# EAGLE design RPCamV2_Alt_camera_boardV2 (EAGLE 9.3.2)
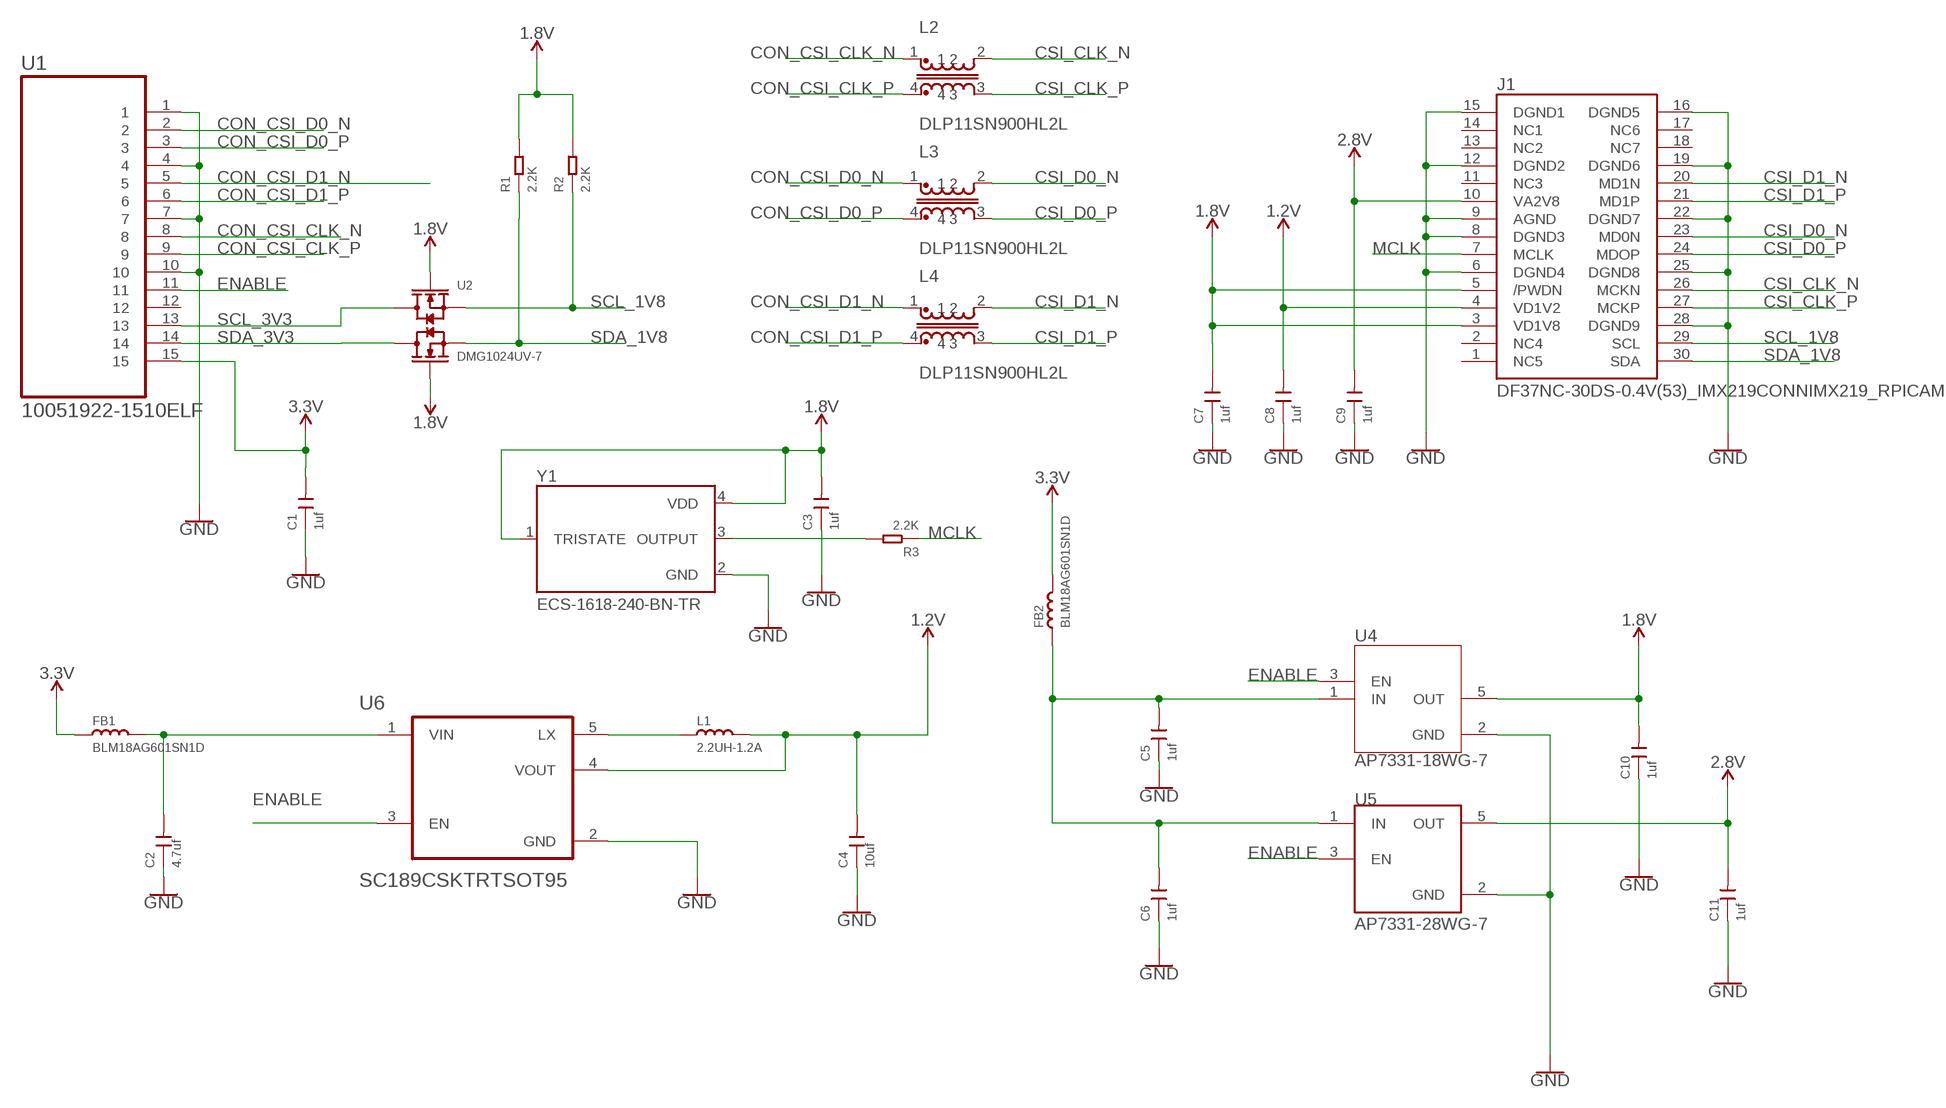
[diagram p0: schematic, sheet 1]

## Parts
C1  1uf  CERAMIC-1UF-10V-10%-X5R(0402)  [C0402K]
C2  4.7uf  CERAMIC-4.7UF-10V-10%-X5R(0603)  [C0603]
C3  1uf  CERAMIC-1UF-10V-10%-X5R(0402)  [C0402K]
C4  10uf  CERAMIC-10UF-25V-10%-X5R(0805)  [C2012]
C5  1uf  CERAMIC-1UF-10V-10%-X5R(0402)  [C0402K]
C6  1uf  CERAMIC-1UF-10V-10%-X5R(0402)  [C0402K]
C7  1uf  CERAMIC-1UF-10V-10%-X5R(0402)  [C0402K]
C8  1uf  CERAMIC-1UF-10V-10%-X5R(0402)  [C0402K]
C9  1uf  CERAMIC-1UF-10V-10%-X5R(0402)  [C0402K]
C10  1uf  CERAMIC-1UF-10V-10%-X5R(0402)  [C0402K]
C11  1uf  CERAMIC-1UF-10V-10%-X5R(0402)  [C0402K]
FB1  BLM18AG601SN1D  [BEADC1608X80]
FB2  BLM18AG601SN1D  [BEADC1608X80]
J1  DF37NC-30DS-0.4V(53)_IMX219CONNIMX219_RPICAM  [HRS_DF37NC-30DS-0.4V(53)_IMX219]
L1  2.2UH-1.2A  SMD-INDUCTOR-2.2UH-20%-1.2A(0805)  [L0805]
L2  DLP11SN900HL2L  [INDC1210X09]
L3  DLP11SN900HL2L  [INDC1210X09]
L4  DLP11SN900HL2L  [INDC1210X09]
R1  2.2K  SMD-RES-2.2K-5%-1/16W(0402)  [R0402]
R2  2.2K  SMD-RES-2.2K-5%-1/16W(0402)  [R0402]
R3  2.2K  SMD-RES-2.2K-5%-1/16W(0402)  [R0402]
U1  10051922-1510ELF  [FCI_10051922-1510ELF]
U2  DMG1024UV-7  [SOT50P162X60-6N]
U4  AP7331-18WG-7  [SOT95P285X145-5N]
U5  AP7331-28WG-7  [SOT95P285X145-5N]
U6  SC189CSKTRTSOT95  [SOT95P285X145-5N]
Y1  ECS-1618-240-BN-TR  [XTAL_ECS-1618-060-BN-TR]

## Nets
1.2V [pwr]: C4.2 C8.2 J1.4(VD1V2) L1.2 U6.4(VOUT)
1.8V [pwr]: C3.2 C7.2 C10.2 J1.3(VD1V8) J1.5(/PWDN) R1.2 R2.2 U2.G1(G0) U2.G2(G1) U4.5(OUT) Y1.1(TRISTATE) Y1.4(VDD)
2.8V [pwr]: C9.2 C11.2 J1.10(VA2V8) U5.5(OUT)
3V3 [pwr]: C1.2 FB1.1 FB2.2 U1.15 ; supply symbol labelled 3.3V
CON_CSI_CLK_N [diff pairs]: L2.1 U1.8
CON_CSI_CLK_P [diff pairs]: L2.4 U1.9
CON_CSI_D0_N [diff pairs]: L3.1 U1.2
CON_CSI_D0_P [diff pairs]: L3.4 U1.3
CON_CSI_D1_N [diff pairs]: L4.1 U1.5
CON_CSI_D1_P [diff pairs]: L4.4 U1.6
CSI_CLK_N [diff pairs]: J1.26(MCKN) L2.2
CSI_CLK_P [diff pairs]: J1.27(MCKP) L2.3
CSI_D0_N [diff pairs]: J1.23(MD0N) L3.2
CSI_D0_P [diff pairs]: J1.24(MDOP) L3.3
CSI_D1_N [diff pairs]: J1.20(MD1N) L4.2
CSI_D1_P [diff pairs]: J1.21(MD1P) L4.3
ENABLE: U1.11 U4.3(EN) U5.3(EN) U6.3(EN)
GND [pwr]: C1.1 C2.1 C3.1 C4.1 C5.1 C6.1 C7.1 C8.1 C9.1 C10.1 C11.1 J1.6(DGND4) J1.8(DGND3) J1.9(AGND) J1.12(DGND2) J1.15(DGND1) J1.16(DGND5) J1.19(DGND6) J1.22(DGND7) J1.25(DGND8) J1.28(DGND9) U1.1 U1.4 U1.7 U1.10 U4.2(GND) U5.2(GND) U6.2(GND) Y1.2(GND)
IN_PR: C5.2 C6.2 FB2.1 U4.1(IN) U5.1(IN)
MCLK: J1.7(MCLK) R3.1
N$1: C2.2 FB1.2 U6.1(VIN)
N$5: R3.2 Y1.3(OUTPUT)
N$7 [pwr]: L1.1 U6.5(LX)
SCL_1V8: J1.29(SCL) R2.1 U2.S2(S1)
SCL_3V3: U1.13 U2.D2(D1)
SDA_1V8: J1.30(SDA) R1.1 U2.S1(S0)
SDA_3V3: U1.14 U2.D1(D0)
Unconnected: J1.1(NC5) J1.2(NC4) J1.11(NC3) J1.13(NC2) J1.14(NC1) J1.17(NC6) J1.18(NC7) U1.12

## Library data of the parts
C1 C3 C5-C11 = RPI_CAM:CERAMIC-1UF-10V-10%-X5R(0402): 302010040; MPN: MF-CAP-0402-1uF; MPN_SEEED: CC0402KRX5R6BB105
C2 = RPI_CAM:CERAMIC-4.7UF-10V-10%-X5R(0603): 302010111; MPN: CC0603KRX5R6BB475
C4 = RPI_CAM:CERAMIC-10UF-25V-10%-X5R(0805): 302010178; MPN: CC0805KKX5R8BB106
FB1 FB2 = RPI_CAM:BLM18AG601SN1D: Ferrite Beads Multi-Layer 600Ohm 25% 100MHz 500mA 380mOhm DCR 0603 Paper T/R; MPN: BLM18AG601SN1D
J1 = RPI_CAM:DF37NC-30DS-0.4V(53)_IMX219CONN: Connector, Stacking, Rcpt, 30pos, 2row; MPN: DF37NC-30DS-0.4V(51)
L1 = RPI_CAM:SMD-INDUCTOR-2.2UH-20%-1.2A(0805): 303010086; MPN: LQM2MPN2R2MG0
L2-L4 = RPI_CAM:DLP11SN900HL2L: MURATA# DLP11SN900HL2L, D LP Series 90 Ohm Impedanc e 20 % 150 mA DCR 1.5 Ohm SMT Common Mode Choke; AVAILABILITY: Unavailable; DESCRIPTION: MURATA# DLP11SN900HL2L, D LP Series 90 Ohm Impedanc e 20 % 150 mA DCR 1.5 Ohm SMT Common Mode Choke; MF: Murata; MPN: DLP11SN900HL2L; PACKAGE: 1210 Murata; PRICE: None
R1-R3 = RPI_CAM:SMD-RES-2.2K-5%-1/16W(0402): 301010039; MPN: RC0402JR-072K2L
U1 = RPI_CAM:10051922-1510ELF: FFC/FPC CONNECTOR, 15POS, 1ROW; AVAILABILITY: Good; DESCRIPTION: Conn; Rect; FPC/FFC; ZIF; 15Cnts; SMT; VLL Series; 0.5mmPinSpng; RtAng; LowerSideContact; MF: FCI; MPN: 10051922-1510ELF; PACKAGE: None; PRICE: 0.44 USD
U2 = RPI_CAM:DMG1024UV-7: Dual N-Channel 20 V 450 mOhm Surface Mount Enhancement Mode Mosfet - SOT-563; AVAILABILITY: Good; DESCRIPTION: Dual N-Channel 20 V 450 mOhm Surface Mount Enhancement Mode Mosfet - SOT-563; MF: Diodes Inc.; MPN: DMG1024UV-7; PACKAGE: SOT-563 Diodes Inc.; PRICE: 0.19 USD
U4 = RPI_CAM:AP7331-18WG-7: LDO Regulator Pos 1.8V 0.3A 5-Pin SOT-25 T/R; AVAILABILITY: Good; DESCRIPTION: LDO Regulator Pos 1.8V 0.3A 5-Pin SOT-25 T/R; MF: Diodes Inc.; MPN: AP7331-18WG-7; PACKAGE: SOT-753 Diodes Inc.; PRICE: 0.20 USD
U5 = RPI_CAM:AP7331-28WG-7: LDO Regulator Pos 2.8V 0.3A 5-Pin SOT-25 T/R; AVAILABILITY: Good; DESCRIPTION: LDO Regulator Pos 2.8V 0.3A 5-Pin SOT-25 T/R; MF: Diodes Inc.; MPN: AP7331-28WG-7; PACKAGE: SOT-753 Diodes Inc.; PRICE: 0.21 USD
U6 = RPI_CAM:SC189CSKTRT: 1.2V Switching Voltage Regulators 2.5MHz-1.5A SYNC STEP DOWN REG None; MPN: SC189CSKTRT
Y1 = RPI_CAM:ECS-1618-240-BN-TR: OSC XO 12.000MHZ CMOS SMD; DESCRIPTION: Clock Oscillator 24MHz 1.8V 15pF 4-Pin SMD T/R; DIGI-KEY_PART_NUMBER: XC1963CT-ND; DIGI-KEY_PURCHASE_URL: https://www.digikey.com.au/product-detail/en/ecs-inc/ECS-1618-240-BN-TR/XC1963CT-ND/3927364?utm_source=snapeda&utm_medium=aggregator&utm_campaign=symbol; MF: ECS International; MPN: ECS-1618-240-BN-TR; PACKAGE: SMD-4 ECS International

## Net classes
1 diff pairs: width 0.203 mm, clearance 0.152 mm
2 pwr: width 0.152 mm

## Board
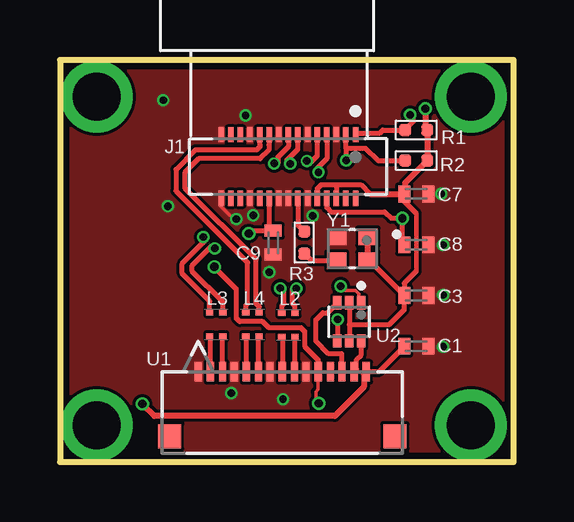
[diagram p1: board, top side]
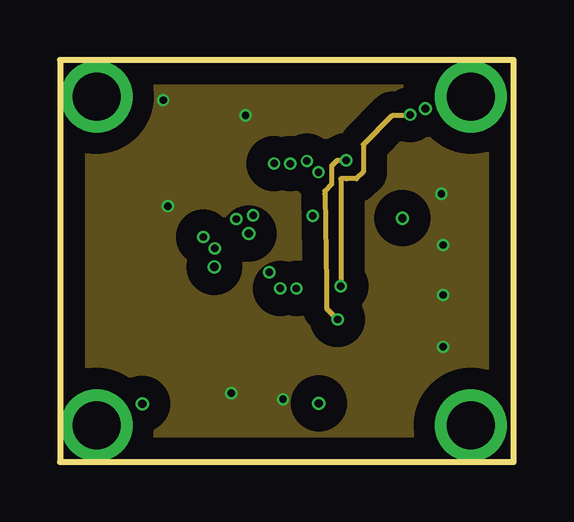
[diagram p2: board, inner layer Route2]
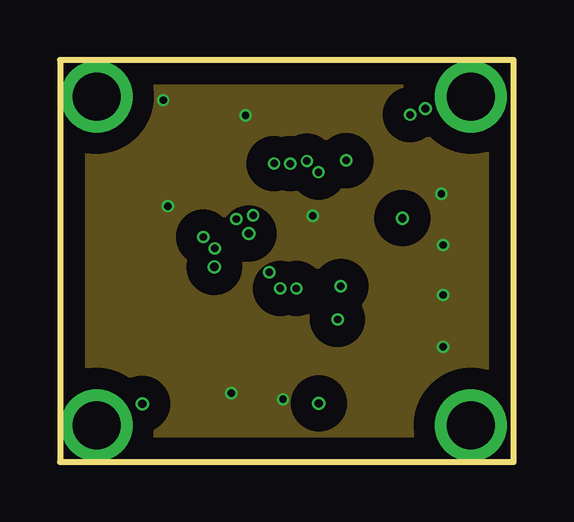
[diagram p3: board, inner layer Route15]
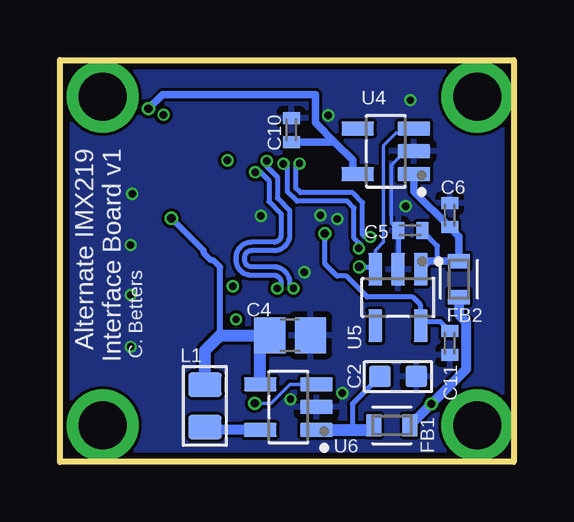
[diagram p4: board, bottom side, seen from below]

Size 18.92 x 16.76 mm. Coordinates in mm from the lower left corner, seen from the top.
Outline: 0,0 18.92,0 18.92,16.76 0,16.76 0,0
Copper layers (1*2*15*16): Top 0.035mm / dielectric 0.23mm / Route2 0.035mm / dielectric 0.93mm / Route15 0.035mm / dielectric 0.23mm / Bottom 0.035mm
Design rules "MF_Standard_4_Layer": minimum track width 5mil, minimum drill 10mil, track to track 5mil, track to pad 5mil, pad to pad 5mil, via to via 5mil, smd to smd 0mil, copper to edge 10mil, drill to drill 10mil, minimum pad ring 4mil, minimum via ring 4mil, stop-mask expansion 2mil, vias tented up to drill 25mil, thermal gap 10mil

### Footprints (pad centres in the part's own frame; a part is rotated, then mirrored left to right if it is on the bottom)
C0402K = smd 0.5 x 0.7: 1 -0.5,0; 2 0.5,0
C0603 = smd 0.889 x 0.889: 1 -0.762,0; 2 0.762,0
C2012 = smd 1.3 x 1.5: 1 -0.85,0; 2 0.85,0
BEADC1608X80 = smd 0.612 x 0.912: 1 -0.75,0; 2 0.75,0
HRS_DF37NC-30DS-0.4V(53)_IMX219 = smd 0.23 x 0.63: 1 -2.8,1.325; 2 -2.4,1.325; 3 -2,1.325; 4 -1.6,1.325; 5 -1.2,1.325; 6 -0.8,1.325; 7 -0.4,1.325; 8 0,1.325; 9 0.4,1.325; 10 0.8,1.325; 11 1.2,1.325; 12 1.6,1.325; 13 2,1.325; 14 2.4,1.325; 15 2.8,1.325; 16 2.8,-1.325; 17 2.4,-1.325; 18 2,-1.325; 19 1.6,-1.325; 20 1.2,-1.325; 21 0.8,-1.325; 22 0.4,-1.325; 23 0,-1.325; 24 -0.4,-1.325; 25 -0.8,-1.325; 26 -1.2,-1.325; 27 -1.6,-1.325; 28 -2,-1.325; 29 -2.4,-1.325; 30 -2.8,-1.325
L0805 = smd 1.016 x 1.397: 1 -0.889,0; 2 0.889,0
INDC1210X09 = smd 0.25 x 0.3: 1 -0.5,0.275; 2 0.5,0.275; 3 0.5,-0.275; 4 -0.5,-0.275
R0402 = smd 0.5 x 0.5: 1 0,0.463; 2 0,-0.463
FCI_10051922-1510ELF = smd 0.305 x 0.813: 1 3.505,-2.108; 2 2.997,-2.108; 3 2.489,-2.108; 4 2.007,-2.108; 5 1.499,-2.108; 6 0.991,-2.108; 7 0.508,-2.108; 8 0,-2.108; 9 -0.508,-2.108; 10 -0.991,-2.108; 11 -1.499,-2.108; 12 -2.007,-2.108; 13 -2.489,-2.108; 14 -2.997,-2.108; 15 -3.505,-2.108 | smd 0.965 x 1.016: 16 -4.699,0.584; 17 4.699,0.584
SOT50P162X60-6N = smd 0.55 x 0.34: D1 0.795,0.5; D2 -0.795,-0.5; G1 -0.795,0; G2 0.795,0; S1 -0.795,0.5; S2 0.795,-0.5
SOT95P285X145-5N = smd 1.37 x 0.59: 1 -1.175,0.95; 2 -1.175,0; 3 -1.175,-0.95; 4 1.175,-0.95; 5 1.175,0.95
XTAL_ECS-1618-060-BN-TR = smd 0.8 x 0.7: 1 -0.65,-0.5; 2 0.65,-0.5; 3 0.65,0.5; 4 -0.65,0.5

### Placement (x,y rotation side)
C1  14.86,4.83 180 top
C2  4.83,3.56 180 bottom
C3  14.86,6.94 180 top
C4  9.32,5.28 180 bottom
C5  4.32,9.65 0 bottom
C6  2.67,10.29 270 bottom
C7  14.86,11.18 180 top
C8  14.86,9.06 180 top
C9  8.89,9.15 90 top
C10  9.27,13.84 270 bottom
C11  2.67,4.95 90 bottom
FB1  5.08,1.52 180 bottom
FB2  2.29,7.62 270 bottom
J1  9.53,12.32 180 top
L1  12.88,2.34 90 bottom
L2  9.53,5.71 90 top
L3  6.52,5.73 90 top
L4  8.03,5.73 90 top
R1  14.86,13.84 90 top
R2  14.86,12.57 90 top
R3  10.19,9.15 0 top
U1  9.27,1.65 180 top
U2  12.06,5.84 270 top
U4  5.33,12.95 180 bottom
U5  4.83,6.86 270 bottom
U6  9.4,2.29 180 bottom
Y1  12.19,8.89 180 top

### Tracks (layer width: path | path; a pad name or v marks a point on that pad's centre or on a via)
1.2V  (via drill 0.35)
  Top 0.203: J1.4 11.12,10.61 11.3,10.43 13.55,10.43 13.81,10.16 v14.28,10.16 14.28,9.14 C8.2
  Bottom 0.254: 12.24,5.28 12.24,8.13 12.53,8.41 12.63,8.41 12.93,8.71 12.93,8.81 v14.28,10.16
  Bottom 0.508: U6.4 10.57,4.88 C4.2 12.24,5.28 12.88,4.65 L1.2
1.8V  (via drill 0.35)
  Top 0.178: 14.86,10.36 14.86,7.95
  Top 0.203: 11.53,11.56 J1.3 | J1.5 10.72,11.38 10.9,11.56 11.53,11.56 | 11.53,11.56 12.54,11.56 12.93,11.18 | U2.G1 12.06,5.71 | 12.06,5.71 U2.G2 | C3.2 12.91,8.39 Y1.4 | C3.2 14.36,6.35 13.73,5.72 12.07,5.72 12.06,5.71 | C7.2 14.36,10.86 14.86,10.36 | C3.2 14.36,7.45 14.86,7.95
  Top 0.254: v15.24,14.73 15.24,13.97 15.32,13.89 R1.2 R2.2 14.4,11.65 C7.2 12.93,11.18 | Y1.4 Y1.1
  Bottom 0.305: v15.24,14.73 14.65,15.32 8.27,15.32 8.27,14.15 7.47,13.34 | U4.5 6.71,12.2 6.71,12.58 7.47,13.34 | C10.2 7.47,13.34
2.8V  (via drill 0.35)
  Top 0.203: v7.87,9.53 8,9.65 C9.2 8.72,9.81 J1.10
  Bottom 0.152: 3.94,5.57 3.86,5.66
  Bottom 0.203: v7.87,9.53 7.87,8.26 7.37,7.75 6.98,7.75 6.1,6.87 4.21,6.87 3.88,6.54 3.88,5.84 | U5.5 3.88,5.84 | C11.2 3.06,5.84 3.88,5.84
  Bottom 0.305: 3.86,5.66 U5.5
3V3  (via drill 0.35)
  Top 0.203: C1.2 13.29,3.76 U1.15
  Top 0.254: U1.15 12.68,3.66 12.68,3.12 11.46,1.91 3.94,1.91 v3.44,2.42
  Bottom 0.406: FB2.2 2.29,6.14 1.99,5.84 1.99,3.87 v3.44,2.42 FB1.1
CON_CSI_CLK_N
  Top 0.203: L2.1 9.27,5.19 U1.8
CON_CSI_CLK_P
  Top 0.203: U1.9 9.8,3.78 L2.4
CON_CSI_D0_N
  Top 0.203: U1.2 6.27,5.2 L3.1
CON_CSI_D0_P
  Top 0.203: U1.3 L3.4
CON_CSI_D1_N
  Top 0.203: U1.5 7.77,5.21 L4.1
CON_CSI_D1_P
  Top 0.203: U1.6 8.28,5.21 L4.4
CSI_CLK_N  (via drill 0.3)
  Top 0.203: J1.26 10.72,12.75 10.41,12.44 v10.3,12.55 | L2.2 9.25,6.51 9.35,6.6 9.35,7.24 v9.19,7.24
  Bottom 0.203: v10.3,12.55 10.41,12.44 9.86,11.88 9.86,11 9.35,10.49 9.35,9.45 arc90 9.99,8.81 10.94,8.81 arc-90 11.23,8.52 11.23,8.43 arc-90 10.94,8.14 9.99,8.14 arc90 9.35,7.49 9.35,7.24 v9.19,7.24
CSI_CLK_P  (via drill 0.3)
  Top 0.203: J1.27 11.12,12.65 10.67,12.19 v10.78,12.08 | L2.3 9.8,6.51 9.7,6.6 9.7,7.24 v9.86,7.24
  Bottom 0.203: v10.78,12.08 10.67,12.19 10.21,11.74 10.21,10.85 9.7,10.34 9.7,9.45 arc90 9.99,9.16 10.94,9.16 arc-90 11.59,8.52 11.59,8.43 arc-90 10.94,7.79 9.99,7.79 arc90 9.7,7.49 9.7,7.24 v9.86,7.24
CSI_D0_N  (via drill 0.3)
  Top 0.203: J1.23 9.53,13.14 9.09,12.71 9.09,12.45 v8.93,12.45 | L3.2 6.25,6.71 5.1,7.86 5.1,8.27 6.09,9.27 v5.98,9.38
  Bottom 0.203: v8.93,12.45 9.09,12.45 9.09,11.42 8.9,11.23 6.71,11.23 6.3,10.82 6.3,9.47 6.09,9.27 v5.98,9.38
CSI_D0_P  (via drill 0.3)
  Top 0.203: J1.24 9.93,13.04 9.45,12.56 9.45,12.44 v9.61,12.44 | L3.3 6.79,6.66 5.51,7.95 5.51,8.18 6.35,9.02 v6.46,8.91
  Bottom 0.203: v9.61,12.44 9.45,12.44 9.45,11.27 9.05,10.87 6.93,10.87 6.66,10.59 6.66,9.32 6.35,9.02 v6.46,8.91
CSI_D1_N
  Top 0.203: J1.20 8.32,13.26 8.35,13.23 8.35,13.15 8.2,13.01 5.64,13.01 4.83,12.2 4.83,11.3 7.82,8.31 7.82,6.6 7.75,6.54 L4.2
CSI_D1_P
  Top 0.203: J1.21 8.72,13.24 8.71,13.23 8.71,13.01 8.35,12.65 5.79,12.65 5.2,12.06 5.2,11.43 8.18,8.46 8.18,6.6 8.3,6.48 L4.3
ENABLE  (via drill 0.35)
  Top 0.152: U1.11 10.77,3.02 10.67,2.92 10.67,2.57 v10.79,2.44
  Top 0.203: v6.44,8.13 7.35,7.22 7.35,6 7.5,5.85 8.45,5.85 8.71,5.59 10.05,5.59 10.2,5.45 10.2,4.83 10.77,4.26 U1.11
  Bottom 0.152: U4.3 4.36,13.71 4.9,13.71 5.42,13.19 5.42,9.17 5.78,8.82 U5.3 | U6.3 9.33,3.24 10.13,2.44 v10.79,2.44
  Bottom 0.203: v6.44,8.13 5.88,8.13 U5.3
GND  (via drill 0.3)
  Top 0.152: J1.15 6.73,10.64 7.23,10.13
  Top 0.203: J1.15 | 7.23,10.13 v7.36,10.13
  Bottom 0.152: U4.2 4.52,12.95 5.1,12.38 5.1,9.93 C5.1
  Bottom 0.203: C5.1 4.82,8.12 4.78,8.08
  Bottom 0.254: 4.78,8.08 U5.2 | 2.71,10.79 C6.1
  other vias: 15.91,11.18 15.98,6.96 8.06,10.28 10.54,10.26 8.73,7.91 15.98,9.05 4.31,15.09 7.15,2.87 9.31,2.61 4.5,10.66 15.98,4.8 7.74,14.45
  pour Top (no thermals): -2.95,19.89 29.77,19.89 29.77,-4.09 -2.95,-4.09
  pour Bottom (rank 4): -0.64,17.27 27.3,17.27 27.3,-0.64 -0.64,-0.64
  pour Route2 (isolate 0.889, rank 3): -1.14,17.91 27.81,17.91 27.81,-1.4 -1.14,-1.4
  pour Route15 (isolate 0.889, rank 2): -2.41,19.3 29.46,19.3 29.46,-3.68 -2.41,-3.68
IN_PR
  Bottom 0.203: C6.2 2.69,9.85 | U5.1 3.86,8.05 | 3.86,9.61 C5.2 3.17,9.01 3.17,8.37
  Bottom 0.305: U5.1 3.54,8.37 3.17,8.37 FB2.1 2.29,9.41 C6.2 4.16,11.28 U4.1
  Bottom 0.406: C5.2
MCLK
  Top 0.203: J1.7 9.93,9.87 R3.1 | R3.1
MOUNTHOLE1  (via drill 2)
  other vias: 1.52,15.24
MOUNTHOLE2  (via drill 2)
  other vias: 1.52,1.52
MOUNTHOLE3  (via drill 2)
  other vias: 17.14,1.52
MOUNTHOLE4  (via drill 2)
  other vias: 17.14,15.24
N$1
  Bottom 0.203: C2.2 6.73,2.41 6.73,1.34
  Bottom 0.508: U6.1 6.73,1.34 6.02,1.34 FB1.2
N$5
  Top 0.203: R3.2 10.48,8.39 Y1.3
N$7
  Bottom 0.406: U6.5 12.77,1.34 L1.1
SCL_1V8  (via drill 0.3)
  Top 0.203: R2.1 13.25,12.57 12.75,13.07 11.94,13.07 11.94,13.08 | v11.58,5.94 11.58,5.06 U2.S2 | v11.94,12.57 11.94,13.08 | 11.94,13.08 11.93,13.09 J1.29
  Route2 0.203: v11.58,5.94 11.12,6.4 11.12,7.41 11.05,11.18 11.05,11.3 11.33,11.58 11.33,12.34 11.56,12.57 v11.94,12.57
SCL_3V3
  Top 0.203: U1.13 11.76,4.51 11.2,4.51 10.67,5.05 10.67,5.92 10.97,6.22 11.15,6.22 U2.D2
SDA_1V8  (via drill 0.3)
  Top 0.152: v11.71,7.33 11.9,7.14 12.33,7.14 12.46,7.01 12.46,6.74 U2.S1
  Top 0.203: J1.30 12.4,13.72 13.34,13.72 13.46,13.84 R1.1 14.73,14.18 14.73,14.35 v14.61,14.48
  Route2 0.203: v11.71,7.33 11.71,11.81 11.96,11.81 11.97,11.81 12.37,11.81 12.65,12.09 12.65,13.24 13.87,14.45 14.58,14.45 v14.61,14.48
SDA_3V3
  Top 0.203: U1.14 12.37,3.86 12.37,4.27 12.56,4.47 U2.D1

### Text on the board
bPlace: Alternate IMX219 / Interface Board v1 | C. Betters